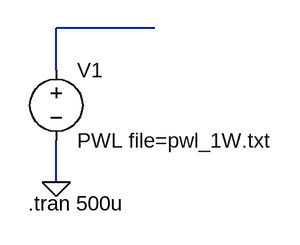
[diagram p0: schematic PWLPlot.asc]
PWLPlot.asc, the LTspice schematic file:
Version 4
SHEET 1 880 680
WIRE 224 32 112 32
WIRE 112 80 112 32
WIRE 112 208 112 160
FLAG 112 208 0
SYMBOL voltage 112 64 R0
WINDOW 123 0 0 Left 0
WINDOW 39 0 0 Left 0
SYMATTR InstName V1
SYMATTR Value PWL file=pwl_1W.txt
TEXT 80 232 Left 2 !.tran 500u

The netlist it stands for:
* PWLPlot.asc
V1 N001 0 PWL file=pwl_1W.txt
.tran 500u
.backanno
.end